# Altium project nPOC-BB_beta_main-board.PrjPcb (part 4 of 4)
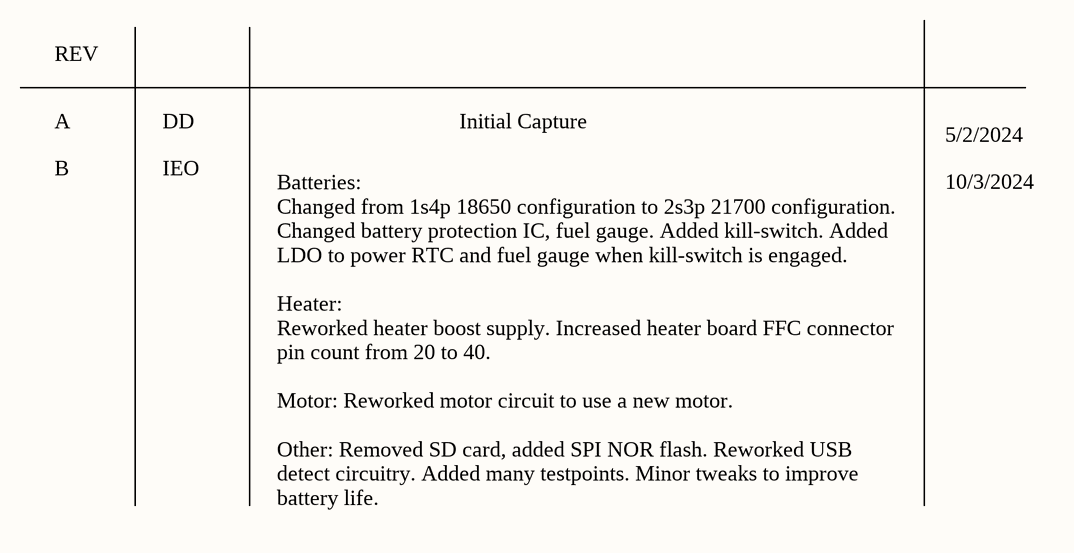
[diagram p7: Revision History.SchDoc]

## Nets that join several sheets
3V3: MCU (7 pins), USB Circuitry (C44.2 R38.2 U8.A2), Battery and Charging (R23.2), Power Supplies (9 pins), Peripherals (R47.2)
3V3_FG_RTC: MCU (R7.2 R8.2), Battery and Charging (5 pins), Peripherals (C4.1 R12.2 U3.10)
3V3_SW: MCU (R5.2 R6.2), Power Supplies (J2.1 J2.2 TP20.1 U15.A1), Peripherals (12 pins)
5V: MCU (C1.2 MD1.66), USB Circuitry (6 pins)
BATT_GND: Battery and Charging (16 pins), Peripherals (C4.2 U3.5)
BQ_IN: USB Circuitry (6 pins), Battery and Charging (9 pins)
GND: MCU (28 pins), USB Circuitry (59 pins), Battery and Charging (27 pins), Power Supplies (65 pins), Peripherals (11 pins)
VBAT: Battery and Charging (15 pins), Power Supplies (15 pins)
3V3_PD_EN: MCU (MD1.58), USB Circuitry (R38.1 U8.B2)
BRAKE_N: MCU (MD1.48), Power Supplies (J1.1 R28.1 R30.2)
CHG_STAT: MCU (MD1.60), Battery and Charging (R23.1 U4.1)
CW/CCW: MCU (MD1.6), Power Supplies (J1.4)
FG_ALRT_N: MCU (MD1.40), Battery and Charging (R11.1 U1.12)
HALL_OUT: MCU (MD1.15), Peripherals (C46.2 R39.2 TP28.1)
HEATER_CTRL: MCU (MD1.57), Power Supplies (Q5.4 R33.2 TP18.1)
HEATER_PWR_EN: MCU (MD1.36), Power Supplies (R26.1 U7.2)
I2C0_SCL: MCU (MD1.34 R6.1 TP12.1), USB Circuitry (U10.9), Power Supplies (J2.3 J2.4), Peripherals (U14.18)
I2C0_SDA: MCU (MD1.35 R5.1 TP13.1), USB Circuitry (U10.8), Power Supplies (J2.5 J2.6), Peripherals (U14.19)
I2C1_SCL: MCU (MD1.41 R8.1 TP14.1), Battery and Charging (U1.14), Peripherals (U3.7)
I2C1_SDA: MCU (MD1.42 R7.1 TP15.1), Battery and Charging (U1.13), Peripherals (U3.6)
LED_DRV_EN: MCU (MD1.59), Peripherals (R48.1 U14.13)
MOTOR_FG: MCU (MD1.20), Power Supplies (J1.3 R29.1 TP22.1)
MOTOR_POWER_EN: MCU (MD1.9), Power Supplies (Q4.4 R27.1 TP29.1 U16.6)
MOTOR_PWM: MCU (MD1.7), Power Supplies (J1.2 TP23.1)
PD_SCL: USB Circuitry (J8.1 R36.1 U10.17 U12.6), Battery and Charging (U4.14)
PD_SDA: USB Circuitry (J8.3 R35.1 U10.16 U12.5), Battery and Charging (U4.15)
RTC_32768kHz: MCU (C2.2 MD1.13 Y1.1), Peripherals (R40.2)
RTC_INT: MCU (MD1.51), Peripherals (R12.1 U3.4)
SENSOR_PWR_EN: MCU (MD1.50), Power Supplies (R59.1 U15.B2)
USB_D_N: MCU (R10.1), USB Circuitry (D4.2 J7.A7 J7.B7)
USB_D_P: MCU (R9.1), USB Circuitry (D4.1 J7.A6 J7.B6)
VBUS_DETECT: MCU (MD1.10), USB Circuitry (R31.1 R37.2)